# Altium schematic sheet Power_Monitoring_TPS3803.SchDoc
size A4; Organization: UltraZohm; SheetNumber: 24; SheetTotal: 40
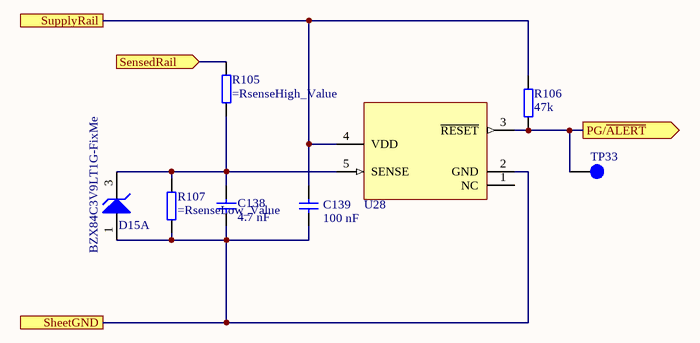
[diagram p0: Power_Monitoring_TPS3803.SchDoc]

## Parts
C138  4.7 nF  [C_0603_TE]
C139  100 nF  [C_0603_TE]
D15  BZX84C3V9LT1G-FixMe  [SOT-23-3_ONSC]  (part A of 2)
R105  (no value)  [R_0603_TE]
R106  47k  [R_0603_TE]
R107  (no value)  [R_0603_TE]
TP33  Testpoint 1mm  [TP_1mm]  (value not drawn)  (no BOM)
U28  TPS3803-01QDCKRQ1  [FP-DCK0005A-IPC_B]  (value not drawn)

## Ports
PG/~{ALERT} (out), SensedRail (in), SheetGND, SupplyRail

## Nets
PG/~{ALERT}: R106.1 TP33.1 U28.3(~{RESET}) ; port PG/~{ALERT}
SensedRail: R105.2 ; port SensedRail
SheetGND: C138.2 C139.1 D15.1(A) R107.1 U28.2(GND) ; port SheetGND
SupplyRail: C139.2 R106.2 U28.4(VDD) ; port SupplyRail
NetC138_1: C138.1 D15.3(K) R105.1 R107.2 U28.5(SENSE)

Not connected (* = marked no-connect by the designer): U28 1(NC)

## Notes on the sheet
- Title
- Revision:
- Design Engineer:
- Date:
- Project:
- Sheet
- of

## Library data of the parts
C138 = GRM1885C1H472JA01D: 50V 4.7nF C0G ±5% 0603 Multilayer Ceramic Capacitors MLCC; Manufacturer: Murata Electronics; Created from: MGeier; Tolerance: 5%; Value: 4.7 nF; Manufacturer Part Number: GRM1885C1H472JA01D; PartID: 153; Created On: 02/08/2024 16:00:00; ComponentLink1Description: Datasheet; ComponentLink1URL: https://wmsc.lcsc.com/wmsc/upload/file/pdf/v2/lcsc/2304140030_Murata-Electronics-GRM1885C1H472JA01D_C85980.pdf; Component Type: Capacitor 0603; Device Package: 0603; Last Updated: 02/08/2024 16:00:00; Mounting Type: SMD; Operating Temperature: –55 to 125°C; Series: GRM (Chip Multilayer Ceramic Capacitors for General Purpose); Supplier 1: LCSC; Supplier Part Number 1: C85980; Type: Capacitor; Voltage Rating: 50 V; Live Cycle Status: 1; LCSC Part Number: C85980; Stock number: not stored
C139 = UZgen_C_0603_100nF_50V_X7R: Generic capacitor; Manufacturer: UZgen; Voltage: 50V; Tolerance: 10 %; Created from: AGeiger; Manufacturer Part Number: UZgen_C_0603_100nF_50V_X7R; PartID: 1; Created On: 02/07/2024 14:42:23; Value: 100 nF; Device Package: 0603; Technology: X7R; Mounting Type: SMD; Last Updated: 08/08/2024 15:01:15
D15 = BZX84C3V9LT1G-FixMe: Zener Diode, 3.9 V, 0.25 W, 5 %; Manufacturer: onsemi; Power Loss: 250 mW; Zener Impedance: 60 Ohm; Value: 3.9V; Created from: FRosner; Manufacturer Part Number: BZX84C3V9LT1G-FixMe; PartID: 19; Created On: 20/11/2024 13:34:23; ComponentLink1Description: Datasheet; ComponentLink1URL: https://www.lcsc.com/datasheet/lcsc_datasheet_2304140030_onsemi-BZX84C3V9LT1G_C94414.pdf; Component Type: Zener Diode; Device Package: SOT-23-3; Last Updated: 20/11/2024 13:33:19; Mounting Type: SMD; Operating Temperature: -65 - 150 °C; Series: BZX84C3V9L; Supplier 1: LCSC; Supplier Part Number 1: C94414; Type: Zener Diode; Live Cycle Status: 1; LCSC Part Number: C94414; Stock number: not stored
R105 R107 = UZgen_R_0603_ParaR: Generic resistor (parametric); Manufacturer: UZgen; Tolerance: 1 %; Created from: UZgenTool; PartID: 588; Created On: 08/07/2024 14:34:30; Device Package: 0603; Mounting Type: SMD; Last Updated: 08/07/2024 14:34:30
  R105: Manufacturer Part Number: =RsenseHigh_MPN; Value: =RsenseHigh_Value
  R107: Manufacturer Part Number: =RsenseLow_MPN; Value: =RsenseLow_Value
R106 = UZgen_R_0603_47k: Generic resistor; Manufacturer: UZgen; Tolerance: 1 %; Created from: UZgenTool; Manufacturer Part Number: UZgen_R_0603_47k; PartID: 260; Created On: 02/07/2024 17:29:50; Value: 47k; Device Package: 0603; Mounting Type: SMD; Last Updated: 02/07/2024 17:29:50
TP33 = NULL: Manufacturer Part Number: NULL; Created from: AGeiger; Created: 2018_06_25_AGeiger; Value: Testpoint 1mm; PartID: 9; Created On: 20/09/2022 13:14:57; Component Type: Testpoint; Last Updated: 20/09/2022 13:15:39; Manufacturer: NULL; Supplier 1: NULL; Supplier Part Number 1: NULL; Type: Testpoint; Live Cycle Status: 1
U28 = TPS3803-01QDCKRQ1: Supervisory Circuits Auto Cat Dual Vltg Detectors; Manufacturer: Texas Instruments; Created from: FRosner; Manufacturer Part Number: TPS3803-01QDCKRQ1; PartID: 6; Created On: 12/07/2024 08:21:41; ComponentLink1Description: Datasheet; ComponentLink1URL: https://www.ti.com/lit/ds/symlink/tps3803-q1.pdf?ts=1720723571308&ref_url=https%253A%252F%252Fwww.mouser.com%252F; Component Type: Supervisory Circuits; Device Package: SC-70; Last Updated: 04/10/2024 21:14:00; Mounting Type: SMD; Operating Temperature: -40 to +125 °C; Series: TPS3803-Q1; Supplier 1: Mouser; Supplier Part Number 1: 595-TPS380301QDCKRQ1; Supplier 2: LCSC; Supplier Part Number 2: C129371; Value: TPS3803-01QDCKRQ1; LCSC Part Number: C129371